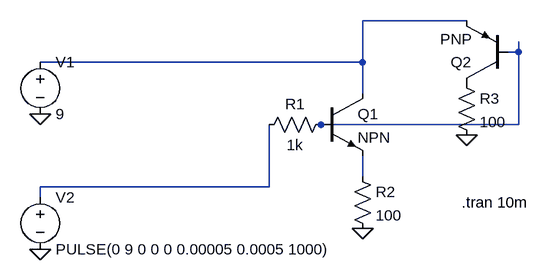
[diagram p0: schematic NPN PNP Switch.asc]
NPN PNP Switch.asc, the LTspice schematic file:
Version 4
SHEET 1 904 680
WIRE 800 48 640 48
WIRE 880 96 880 80
WIRE 880 96 864 96
WIRE 640 112 640 48
WIRE 640 112 144 112
WIRE 640 160 640 112
WIRE 880 208 880 96
WIRE 880 208 576 208
WIRE 640 288 640 256
WIRE 496 304 496 208
WIRE 496 304 144 304
WIRE 144 320 144 304
FLAG 144 192 0
FLAG 144 400 0
FLAG 640 368 0
FLAG 800 224 0
SYMBOL voltage 144 96 R0
SYMATTR InstName V1
SYMATTR Value 9
SYMBOL voltage 144 304 R0
SYMATTR InstName V2
SYMATTR Value PULSE(0 9 0 0 0 0.00005 0.0005 1000)
SYMBOL npn 576 160 R0
SYMATTR InstName Q1
SYMBOL res 592 192 R90
WINDOW 0 0 56 VBottom 2
WINDOW 3 32 56 VTop 2
SYMATTR InstName R1
SYMATTR Value 1k
SYMBOL res 624 272 R0
SYMATTR InstName R2
SYMATTR Value 100
SYMBOL res 784 128 R0
SYMATTR InstName R3
SYMATTR Value 100
SYMBOL pnp 864 144 R180
SYMATTR InstName Q2
TEXT 792 328 Left 2 !.tran 10m

The netlist it stands for:
* NPN PNP Switch.asc
V1 N001 0 9
V2 N004 0 PULSE(0 9 0 0 0 0.00005 0.0005 1000)
Q1 N001 N002 N003 0 NPN
R1 N002 N004 1k
R2 N003 0 100
R3 P001 0 100
Q2 P001 N002 N001 0 PNP
.model NPN NPN
.model PNP PNP
.lib standard.bjt
.tran 10m
.backanno
.end